# Altium schematic sheet DifferenceAmplifier.SchDoc: Difference Amplifier
size A; SheetNumber: 3; SheetTotal: 6
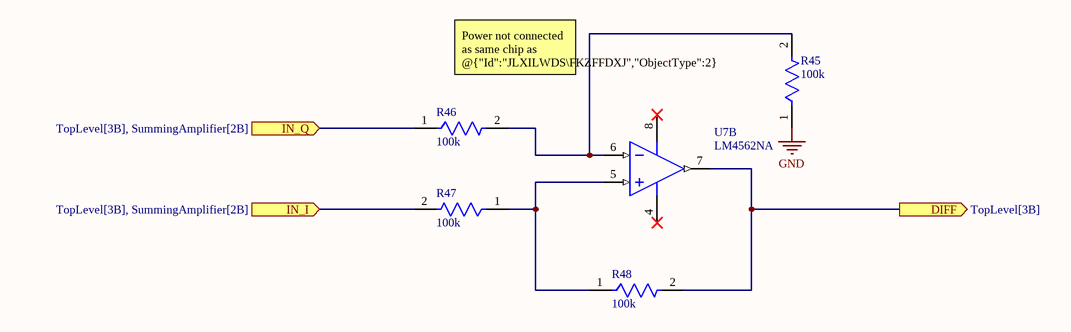
[diagram p0: DifferenceAmplifier.SchDoc]

## Parts
R45  100k  [FP-RC0805-0_6-IPC_C]
R46  100k  [FP-RC0805-0_6-IPC_C]
R47  100k  [FP-RC0805-0_6-IPC_C]
R48  100k  [FP-RC0805-0_6-IPC_C]
U7  LM4562NA  [N08E]  (part B of 2)

## Ports
DIFF (out, see TopLevel[3B]), IN_I (in, see TopLevel[3B], SummingAmplifier[2B]), IN_Q (in, see TopLevel[3B], SummingAmplifier[2B])

## Nets
GND: R45.1
DIFF: R48.2 U7.7(OUT_B) ; port DIFF
IN_I: R47.2 ; port IN_I
IN_Q: R46.1 ; port IN_Q
NetR45_2: R45.2 R46.2 U7.6(IN_B)
NetR47_1: R47.1 R48.1 U7.5(IN_B)

Not connected (* = marked no-connect by the designer): U7 4(V-)* 8(V+)*

## Notes on the sheet
- Power not connected as same chip as @{"Id":"JLXILWDS\FKZFFDXJ","ObjectType":2}

## Library data of the parts
R45-R48 = CMP-2100-03668-5: RES 100K OHM 1% 1/8W 0805; Power Rating: 125mW; Temperature Coefficient: 100ppm/°C; Voltage Rating (DC): 150V; Resistance: 100kR; Package Quantity: 1; Case/Package: 0805; Lead Pitch: 0.4mm; Case Code (Imperial): 0805; Construction: Rectangular; Number of Terminations: 2; RoHS Compliant: Yes; Max Power Dissipation: 125mW; Tolerance: 1%; Max Operating Temperature: 155°C; Resistance Tolerance: 1%; Lead Free: Lead Free; Packaging: Tape and Reel; Resistor Type: Thick Film; Min Operating Temperature: -55°C; Case Code (Metric): 2012; Series: RC; Technology: THICK FILM; Voltage Rating: 150V; Termination: SMD/SMT; Width: 0.049inch; Number of Pins: 2; Features: Moisture Resistant; Military Standard: Not; Length: 0.079inch; Depth: 1.25mm; Size Code: 0805; Height: 0.024inch
U7 = CMP-0057-00043-2: Dual High Performance, High Fidelity Audio Operational Amplifier, 8-pin MDIP; Manufacturer: National Semiconductor; PowerWise: Y; PackageTopMarking: NSUZXYTT*LM*4562NA; CompType: Audio IC; ComponentLink2Description: LM4562 Web Page; PinCount: 8; RoHS: Y; PackageReference: N08E; DatasheetVersion: Jan-2010; RevisionNote: Component URLs added; PackageVersion: revG, May-2006; Code_JEDEC: MS-001-BA; ComponentLink3URL: http://www.national.com/packaging/folders/n08e.html; ComponentLink1Description: LM4562 Datasheet; PackageDescription: MDIP, .365 x .250 x .130in, 8 Lead, .100in Pitch; ComponentLink3Description: N08E Package Page; ComponentLink1URL: http://www.national.com/ds/LM/LM4562.pdf; ComponentLink2URL: http://www.national.com/pf/LM/LM4562.html